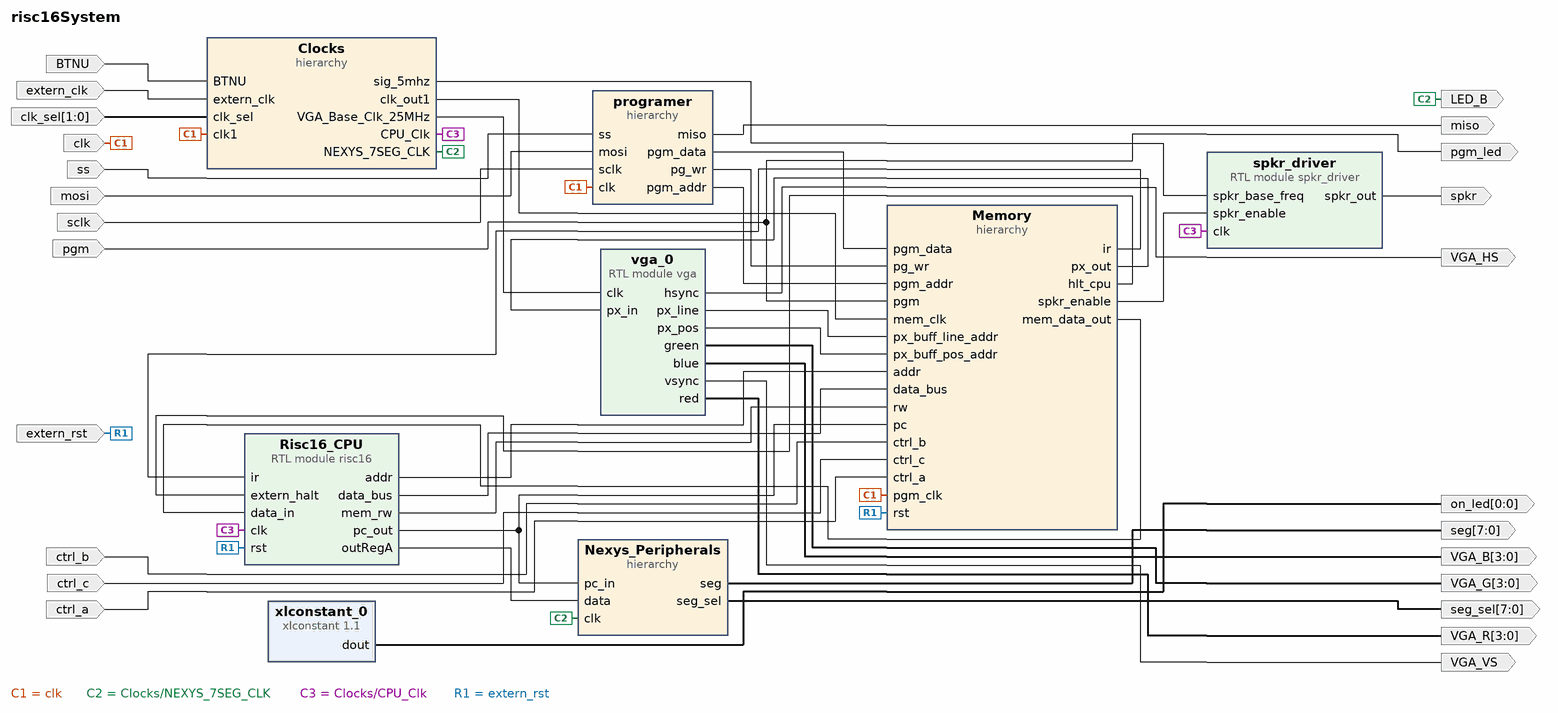
[diagram p0: block diagram of the top level]
# Vivado block design risc16System, xc7a100tcsg324-1, Vivado 2018.3
create_bd_design risc16System

create_bd_port -dir I clk
create_bd_port -dir O -from 7 -to 0 seg
create_bd_port -dir O -from 7 -to 0 seg_sel
create_bd_port -dir I mosi
create_bd_port -dir I sclk
create_bd_port -dir I ss
create_bd_port -dir O miso
create_bd_port -dir O LED_B
create_bd_port -dir I pgm
create_bd_port -dir O pgm_led
create_bd_port -dir I BTNU
create_bd_port -dir O -from 3 -to 0 VGA_R
create_bd_port -dir O -from 3 -to 0 VGA_G
create_bd_port -dir O -from 3 -to 0 VGA_B
create_bd_port -dir O VGA_HS
create_bd_port -dir O VGA_VS
create_bd_port -dir I extern_clk
create_bd_port -dir I -from 1 -to 0 clk_sel
create_bd_port -dir I extern_rst
create_bd_port -dir I ctrl_a
create_bd_port -dir I ctrl_b
create_bd_port -dir I ctrl_c
create_bd_port -dir O spkr
create_bd_port -dir O -from 0 -to 0 on_led

create_bd_cell -type hier programer
create_bd_cell -type hier Clocks
create_bd_cell -type hier Nexys_Peripherals
create_bd_cell -type hier Memory
create_bd_cell -type module -reference risc16 Risc16_CPU
create_bd_cell -type module -reference vga vga_0
create_bd_cell -type module -reference spkr_driver spkr_driver
create_bd_cell -type ip -vlnv xilinx.com:ip:xlconstant:1.1 xlconstant_0

# ---- hierarchy /programer ----
current_bd_instance /programer
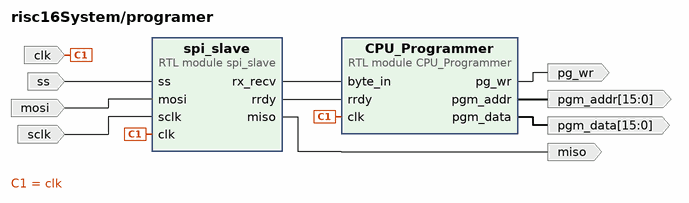
[diagram p1: block diagram inside /programer]
create_bd_pin -dir O miso
create_bd_pin -dir I ss
create_bd_pin -dir I mosi
create_bd_pin -dir I -type clk clk
create_bd_pin -dir I sclk
create_bd_pin -dir O -from 15 -to 0 pgm_data
create_bd_pin -dir O -from 15 -to 0 pgm_addr
create_bd_pin -dir O pg_wr

create_bd_cell -type module -reference spi_slave spi_slave
create_bd_cell -type module -reference CPU_Programmer CPU_Programmer

# ---- hierarchy /Clocks ----
current_bd_instance /Clocks
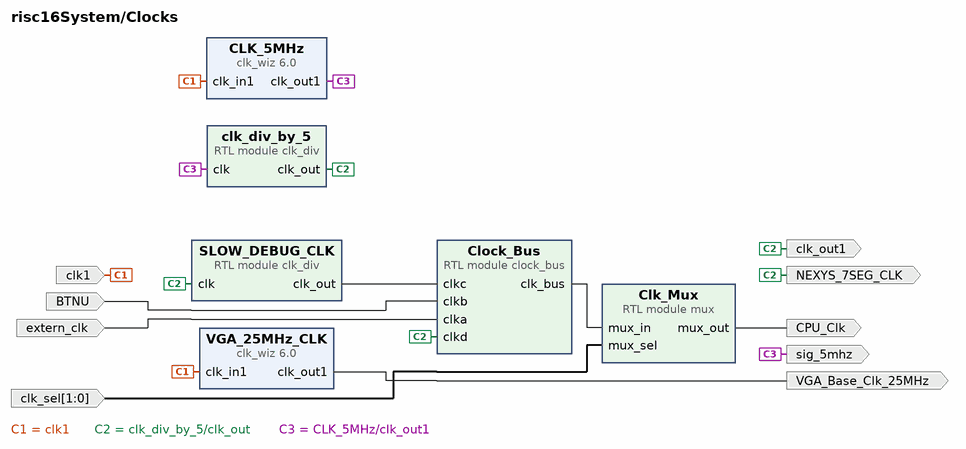
[diagram p2: block diagram inside /Clocks]
create_bd_pin -dir O CPU_Clk
create_bd_pin -dir I BTNU
create_bd_pin -dir I -type clk clk1
create_bd_pin -dir O NEXYS_7SEG_CLK
create_bd_pin -dir O -type clk VGA_Base_Clk_25MHz
create_bd_pin -dir I extern_clk
create_bd_pin -dir I -from 1 -to 0 clk_sel
create_bd_pin -dir O -type clk clk_out1
create_bd_pin -dir O -type clk sig_5mhz

create_bd_cell -type module -reference clk_div SLOW_DEBUG_CLK
set_property -dict {CONFIG.DIV 10} [get_bd_cells SLOW_DEBUG_CLK]
create_bd_cell -type ip -vlnv xilinx.com:ip:clk_wiz:6.0 CLK_5MHz
set_property -dict [list \
  CONFIG.CLKOUT1_JITTER 631.442 \
  CONFIG.CLKOUT1_PHASE_ERROR 346.848 \
  CONFIG.CLKOUT1_REQUESTED_OUT_FREQ 5 \
  CONFIG.MMCM_CLKFBOUT_MULT_F 32.000 \
  CONFIG.MMCM_CLKOUT0_DIVIDE_F 128.000 \
  CONFIG.MMCM_DIVCLK_DIVIDE 5 \
  CONFIG.USE_LOCKED false \
  CONFIG.USE_RESET false \
] [get_bd_cells CLK_5MHz]
create_bd_cell -type module -reference clk_div clk_div_by_5
set_property -dict {CONFIG.DIV 5} [get_bd_cells clk_div_by_5]
create_bd_cell -type ip -vlnv xilinx.com:ip:clk_wiz:6.0 VGA_25MHz_CLK
set_property -dict [list \
  CONFIG.CLKOUT1_JITTER 181.828 \
  CONFIG.CLKOUT1_PHASE_ERROR 104.359 \
  CONFIG.CLKOUT1_REQUESTED_OUT_FREQ 25 \
  CONFIG.MMCM_CLKFBOUT_MULT_F 9.125 \
  CONFIG.MMCM_CLKOUT0_DIVIDE_F 36.500 \
  CONFIG.MMCM_DIVCLK_DIVIDE 1 \
  CONFIG.USE_LOCKED false \
  CONFIG.USE_RESET false \
] [get_bd_cells VGA_25MHz_CLK]
create_bd_cell -type module -reference mux Clk_Mux
set_property -dict {CONFIG.WIDTH 3} [get_bd_cells Clk_Mux]
create_bd_cell -type module -reference clock_bus Clock_Bus

# ---- hierarchy /Nexys_Peripherals ----
current_bd_instance /Nexys_Peripherals
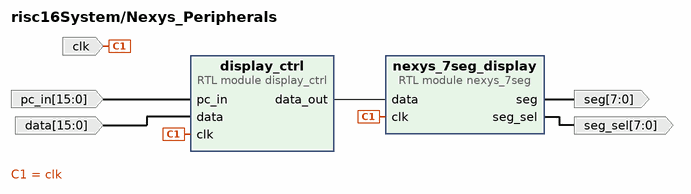
[diagram p3: block diagram inside /Nexys_Peripherals]
create_bd_pin -dir O -from 7 -to 0 seg
create_bd_pin -dir O -from 7 -to 0 seg_sel
create_bd_pin -dir I -type clk clk
create_bd_pin -dir I -from 15 -to 0 pc_in
create_bd_pin -dir I -from 15 -to 0 data

create_bd_cell -type module -reference nexys_7seg nexys_7seg_display
create_bd_cell -type module -reference display_ctrl display_ctrl

# ---- hierarchy /Memory ----
current_bd_instance /Memory
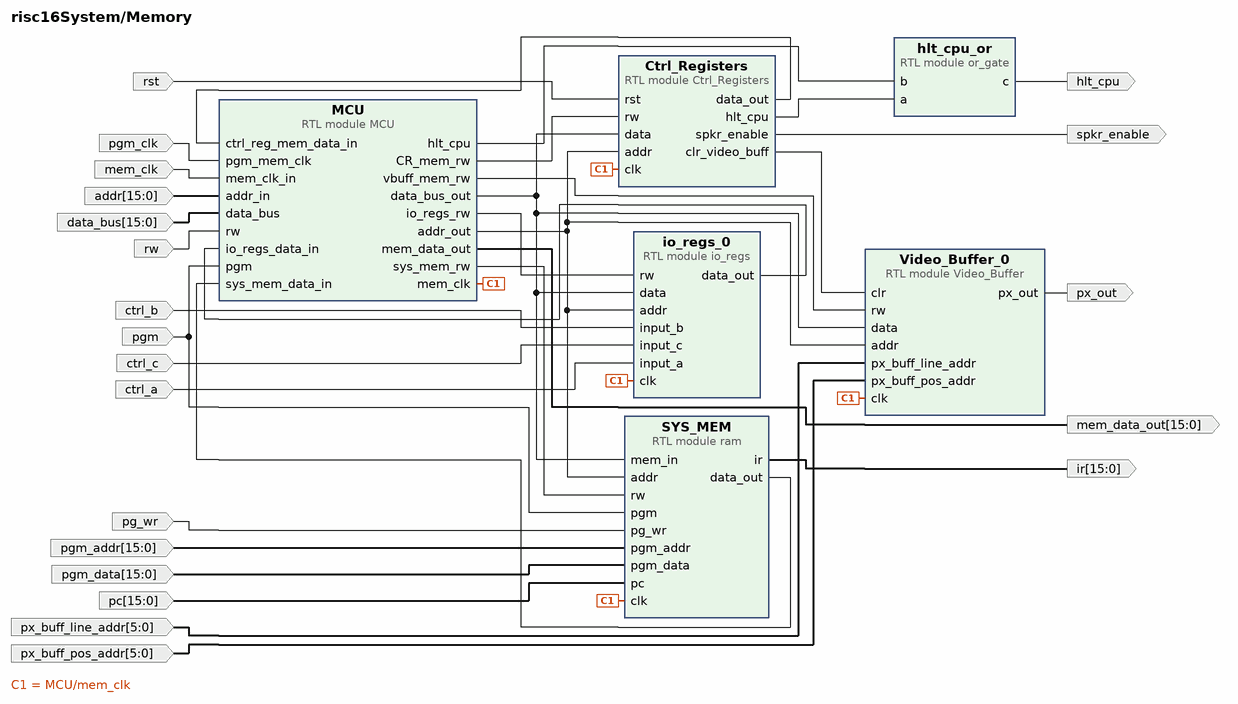
[diagram p4: block diagram inside /Memory]
create_bd_pin -dir I pgm
create_bd_pin -dir O hlt_cpu
create_bd_pin -dir O -from 15 -to 0 ir
create_bd_pin -dir I pg_wr
create_bd_pin -dir I -from 15 -to 0 pgm_addr
create_bd_pin -dir I -from 15 -to 0 pgm_data
create_bd_pin -dir I -from 15 -to 0 pc
create_bd_pin -dir I -type rst rst
create_bd_pin -dir I -type clk pgm_clk
create_bd_pin -dir I mem_clk
create_bd_pin -dir O -from 15 -to 0 mem_data_out
create_bd_pin -dir I -from 15 -to 0 addr
create_bd_pin -dir I -from 15 -to 0 data_bus
create_bd_pin -dir I rw
create_bd_pin -dir O px_out
create_bd_pin -dir I -from 5 -to 0 px_buff_line_addr
create_bd_pin -dir I -from 5 -to 0 px_buff_pos_addr
create_bd_pin -dir I ctrl_b
create_bd_pin -dir I ctrl_c
create_bd_pin -dir I ctrl_a
create_bd_pin -dir O spkr_enable

create_bd_cell -type module -reference or_gate hlt_cpu_or
create_bd_cell -type module -reference Video_Buffer Video_Buffer_0
create_bd_cell -type module -reference io_regs io_regs_0
create_bd_cell -type module -reference MCU MCU
create_bd_cell -type module -reference ram SYS_MEM
create_bd_cell -type module -reference Ctrl_Registers Ctrl_Registers

# ---- connections ----

current_bd_instance /programer
connect_bd_net [get_bd_pins spi_slave/miso] [get_bd_pins miso]
connect_bd_net [get_bd_pins ss] [get_bd_pins spi_slave/ss]
connect_bd_net [get_bd_pins mosi] [get_bd_pins spi_slave/mosi]
connect_bd_net [get_bd_pins clk] [get_bd_pins spi_slave/clk] [get_bd_pins CPU_Programmer/clk]
connect_bd_net [get_bd_pins sclk] [get_bd_pins spi_slave/sclk]
connect_bd_net [get_bd_pins spi_slave/rx_recv] [get_bd_pins CPU_Programmer/byte_in]
connect_bd_net [get_bd_pins spi_slave/rrdy] [get_bd_pins CPU_Programmer/rrdy]
connect_bd_net [get_bd_pins CPU_Programmer/pgm_data] [get_bd_pins pgm_data]
connect_bd_net [get_bd_pins CPU_Programmer/pgm_addr] [get_bd_pins pgm_addr]
connect_bd_net [get_bd_pins CPU_Programmer/pg_wr] [get_bd_pins pg_wr]

current_bd_instance /Clocks
connect_bd_net [get_bd_pins Clk_Mux/mux_out] [get_bd_pins CPU_Clk]
connect_bd_net [get_bd_pins BTNU] [get_bd_pins Clock_Bus/clkb]
connect_bd_net [get_bd_pins Clock_Bus/clk_bus] [get_bd_pins Clk_Mux/mux_in]
connect_bd_net -net clk1_1 [get_bd_pins clk1] [get_bd_pins CLK_5MHz/clk_in1] [get_bd_pins VGA_25MHz_CLK/clk_in1]
connect_bd_net [get_bd_pins VGA_25MHz_CLK/clk_out1] [get_bd_pins VGA_Base_Clk_25MHz]
connect_bd_net [get_bd_pins clk_sel] [get_bd_pins Clk_Mux/mux_sel]
connect_bd_net -net clk_div_by_10_clk_out [get_bd_pins clk_div_by_5/clk_out] \
  [get_bd_pins NEXYS_7SEG_CLK] [get_bd_pins SLOW_DEBUG_CLK/clk] [get_bd_pins clk_out1] [get_bd_pins Clock_Bus/clkd]
connect_bd_net [get_bd_pins CLK_5MHz/clk_out1] [get_bd_pins clk_div_by_5/clk] [get_bd_pins sig_5mhz]
connect_bd_net [get_bd_pins SLOW_DEBUG_CLK/clk_out] [get_bd_pins Clock_Bus/clkc]
connect_bd_net [get_bd_pins extern_clk] [get_bd_pins Clock_Bus/clka]

current_bd_instance /Nexys_Peripherals
connect_bd_net [get_bd_pins nexys_7seg_display/seg] [get_bd_pins seg]
connect_bd_net [get_bd_pins nexys_7seg_display/seg_sel] [get_bd_pins seg_sel]
connect_bd_net [get_bd_pins clk] [get_bd_pins nexys_7seg_display/clk] [get_bd_pins display_ctrl/clk]
connect_bd_net [get_bd_pins pc_in] [get_bd_pins display_ctrl/pc_in]
connect_bd_net [get_bd_pins data] [get_bd_pins display_ctrl/data]
connect_bd_net [get_bd_pins display_ctrl/data_out] [get_bd_pins nexys_7seg_display/data]

current_bd_instance /Memory
connect_bd_net [get_bd_pins pgm] [get_bd_pins MCU/pgm] [get_bd_pins SYS_MEM/pgm]
connect_bd_net -net or_gate_0_c [get_bd_pins hlt_cpu_or/c] [get_bd_pins hlt_cpu]
connect_bd_net -net MCU_data_bus [get_bd_pins MCU/data_bus_out] \
  [get_bd_pins Video_Buffer_0/data] [get_bd_pins io_regs_0/data] [get_bd_pins SYS_MEM/mem_in] \
  [get_bd_pins Ctrl_Registers/data]
connect_bd_net [get_bd_pins SYS_MEM/ir] [get_bd_pins ir]
connect_bd_net [get_bd_pins pg_wr] [get_bd_pins SYS_MEM/pg_wr]
connect_bd_net [get_bd_pins pgm_addr] [get_bd_pins SYS_MEM/pgm_addr]
connect_bd_net [get_bd_pins pgm_data] [get_bd_pins SYS_MEM/pgm_data]
connect_bd_net [get_bd_pins pc] [get_bd_pins SYS_MEM/pc]
connect_bd_net [get_bd_pins MCU/addr_out] \
  [get_bd_pins Video_Buffer_0/addr] [get_bd_pins io_regs_0/addr] [get_bd_pins SYS_MEM/addr] [get_bd_pins Ctrl_Registers/addr]
connect_bd_net -net BTND_1 [get_bd_pins rst] [get_bd_pins Ctrl_Registers/rst]
connect_bd_net [get_bd_pins MCU/mem_clk] \
  [get_bd_pins Video_Buffer_0/clk] [get_bd_pins io_regs_0/clk] [get_bd_pins SYS_MEM/clk] [get_bd_pins Ctrl_Registers/clk]
connect_bd_net -net clk_1 [get_bd_pins pgm_clk] [get_bd_pins MCU/pgm_mem_clk]
connect_bd_net [get_bd_pins MCU/hlt_cpu] [get_bd_pins hlt_cpu_or/b]
connect_bd_net [get_bd_pins SYS_MEM/data_out] [get_bd_pins MCU/sys_mem_data_in]
connect_bd_net [get_bd_pins MCU/sys_mem_rw] [get_bd_pins SYS_MEM/rw]
connect_bd_net -net mem_clk_in_1 [get_bd_pins mem_clk] [get_bd_pins MCU/mem_clk_in]
connect_bd_net [get_bd_pins MCU/mem_data_out] [get_bd_pins mem_data_out]
connect_bd_net -net addr_in_1 [get_bd_pins addr] [get_bd_pins MCU/addr_in]
connect_bd_net [get_bd_pins data_bus] [get_bd_pins MCU/data_bus]
connect_bd_net [get_bd_pins rw] [get_bd_pins MCU/rw]
connect_bd_net [get_bd_pins Video_Buffer_0/px_out] [get_bd_pins px_out]
connect_bd_net [get_bd_pins px_buff_line_addr] [get_bd_pins Video_Buffer_0/px_buff_line_addr]
connect_bd_net [get_bd_pins px_buff_pos_addr] [get_bd_pins Video_Buffer_0/px_buff_pos_addr]
connect_bd_net [get_bd_pins MCU/vbuff_mem_rw] [get_bd_pins Video_Buffer_0/rw]
connect_bd_net [get_bd_pins Ctrl_Registers/hlt_cpu] [get_bd_pins hlt_cpu_or/a]
connect_bd_net [get_bd_pins Ctrl_Registers/data_out] [get_bd_pins MCU/ctrl_reg_mem_data_in]
connect_bd_net [get_bd_pins MCU/CR_mem_rw] [get_bd_pins Ctrl_Registers/rw]
connect_bd_net [get_bd_pins MCU/io_regs_rw] [get_bd_pins io_regs_0/rw]
connect_bd_net [get_bd_pins io_regs_0/data_out] [get_bd_pins MCU/io_regs_data_in]
connect_bd_net [get_bd_pins ctrl_b] [get_bd_pins io_regs_0/input_b]
connect_bd_net [get_bd_pins ctrl_c] [get_bd_pins io_regs_0/input_c]
connect_bd_net [get_bd_pins ctrl_a] [get_bd_pins io_regs_0/input_a]
connect_bd_net [get_bd_pins Ctrl_Registers/clr_video_buff] [get_bd_pins Video_Buffer_0/clr]
connect_bd_net [get_bd_pins Ctrl_Registers/spkr_enable] [get_bd_pins spkr_enable]

current_bd_instance /
connect_bd_net [get_bd_ports clk] [get_bd_pins programer/clk] [get_bd_pins Clocks/clk1] [get_bd_pins Memory/pgm_clk]
connect_bd_net -net clk_div_0_clk_out [get_bd_pins Clocks/NEXYS_7SEG_CLK] [get_bd_ports LED_B] [get_bd_pins Nexys_Peripherals/clk]
connect_bd_net -net CPU_Programmer_0_pgm [get_bd_ports pgm] [get_bd_ports pgm_led] [get_bd_pins Memory/pgm]
connect_bd_net -net risc16_0_pc_out [get_bd_pins Risc16_CPU/pc_out] [get_bd_pins Nexys_Peripherals/pc_in] [get_bd_pins Memory/pc]
connect_bd_net [get_bd_pins programer/miso] [get_bd_ports miso]
connect_bd_net [get_bd_ports ss] [get_bd_pins programer/ss]
connect_bd_net [get_bd_ports mosi] [get_bd_pins programer/mosi]
connect_bd_net [get_bd_ports sclk] [get_bd_pins programer/sclk]
connect_bd_net [get_bd_ports BTNU] [get_bd_pins Clocks/BTNU]
connect_bd_net [get_bd_pins Nexys_Peripherals/seg] [get_bd_ports seg]
connect_bd_net [get_bd_pins Nexys_Peripherals/seg_sel] [get_bd_ports seg_sel]
connect_bd_net [get_bd_pins Risc16_CPU/outRegA] [get_bd_pins Nexys_Peripherals/data]
connect_bd_net [get_bd_pins Clocks/CPU_Clk] [get_bd_pins Risc16_CPU/clk] [get_bd_pins spkr_driver/clk]
connect_bd_net [get_bd_pins programer/pgm_data] [get_bd_pins Memory/pgm_data]
connect_bd_net [get_bd_pins programer/pg_wr] [get_bd_pins Memory/pg_wr]
connect_bd_net [get_bd_pins programer/pgm_addr] [get_bd_pins Memory/pgm_addr]
connect_bd_net [get_bd_pins Memory/ir] [get_bd_pins Risc16_CPU/ir]
connect_bd_net -net Memory_c [get_bd_pins Memory/hlt_cpu] [get_bd_pins Risc16_CPU/extern_halt]
connect_bd_net [get_bd_pins Memory/mem_data_out] [get_bd_pins Risc16_CPU/data_in]
connect_bd_net [get_bd_pins Risc16_CPU/addr] [get_bd_pins Memory/addr]
connect_bd_net [get_bd_pins Risc16_CPU/data_bus] [get_bd_pins Memory/data_bus]
connect_bd_net [get_bd_pins Risc16_CPU/mem_rw] [get_bd_pins Memory/rw]
connect_bd_net [get_bd_ports extern_clk] [get_bd_pins Clocks/extern_clk]
connect_bd_net [get_bd_ports clk_sel] [get_bd_pins Clocks/clk_sel]
connect_bd_net -net mem_clk_1 [get_bd_pins Clocks/clk_out1] [get_bd_pins Memory/mem_clk]
connect_bd_net [get_bd_pins vga_0/hsync] [get_bd_ports VGA_HS]
connect_bd_net [get_bd_pins vga_0/green] [get_bd_ports VGA_G]
connect_bd_net [get_bd_pins vga_0/vsync] [get_bd_ports VGA_VS]
connect_bd_net [get_bd_pins vga_0/blue] [get_bd_ports VGA_B]
connect_bd_net [get_bd_pins vga_0/red] [get_bd_ports VGA_R]
connect_bd_net -net clocks_clk_out2 [get_bd_pins Clocks/VGA_Base_Clk_25MHz] [get_bd_pins vga_0/clk]
connect_bd_net [get_bd_pins Memory/px_out] [get_bd_pins vga_0/px_in]
connect_bd_net [get_bd_pins vga_0/px_line] [get_bd_pins Memory/px_buff_line_addr]
connect_bd_net [get_bd_pins vga_0/px_pos] [get_bd_pins Memory/px_buff_pos_addr]
connect_bd_net -net or_gate_0_c [get_bd_ports extern_rst] [get_bd_pins Risc16_CPU/rst] [get_bd_pins Memory/rst]
connect_bd_net [get_bd_ports ctrl_b] [get_bd_pins Memory/ctrl_b]
connect_bd_net [get_bd_ports ctrl_c] [get_bd_pins Memory/ctrl_c]
connect_bd_net [get_bd_ports ctrl_a] [get_bd_pins Memory/ctrl_a]
connect_bd_net -net spkr_driver_0_spkr_out [get_bd_pins spkr_driver/spkr_out] [get_bd_ports spkr]
connect_bd_net -net Clocks_clk_out3 [get_bd_pins Clocks/sig_5mhz] [get_bd_pins spkr_driver/spkr_base_freq]
connect_bd_net [get_bd_pins Memory/spkr_enable] [get_bd_pins spkr_driver/spkr_enable]
connect_bd_net [get_bd_pins xlconstant_0/dout] [get_bd_ports on_led]

validate_bd_design
save_bd_design
